# EAGLE design mymote-quake (EAGLE 8.0.1)
PROJECT_AUTHOR: TINKERMAN <xose.perez@gmail.com>; PROJECT_LICENSE: CC-SA-BY 3.0; PROJECT_NAME: MYMOTE QUAKE; PROJECT_VERSION: 0.1.20170508
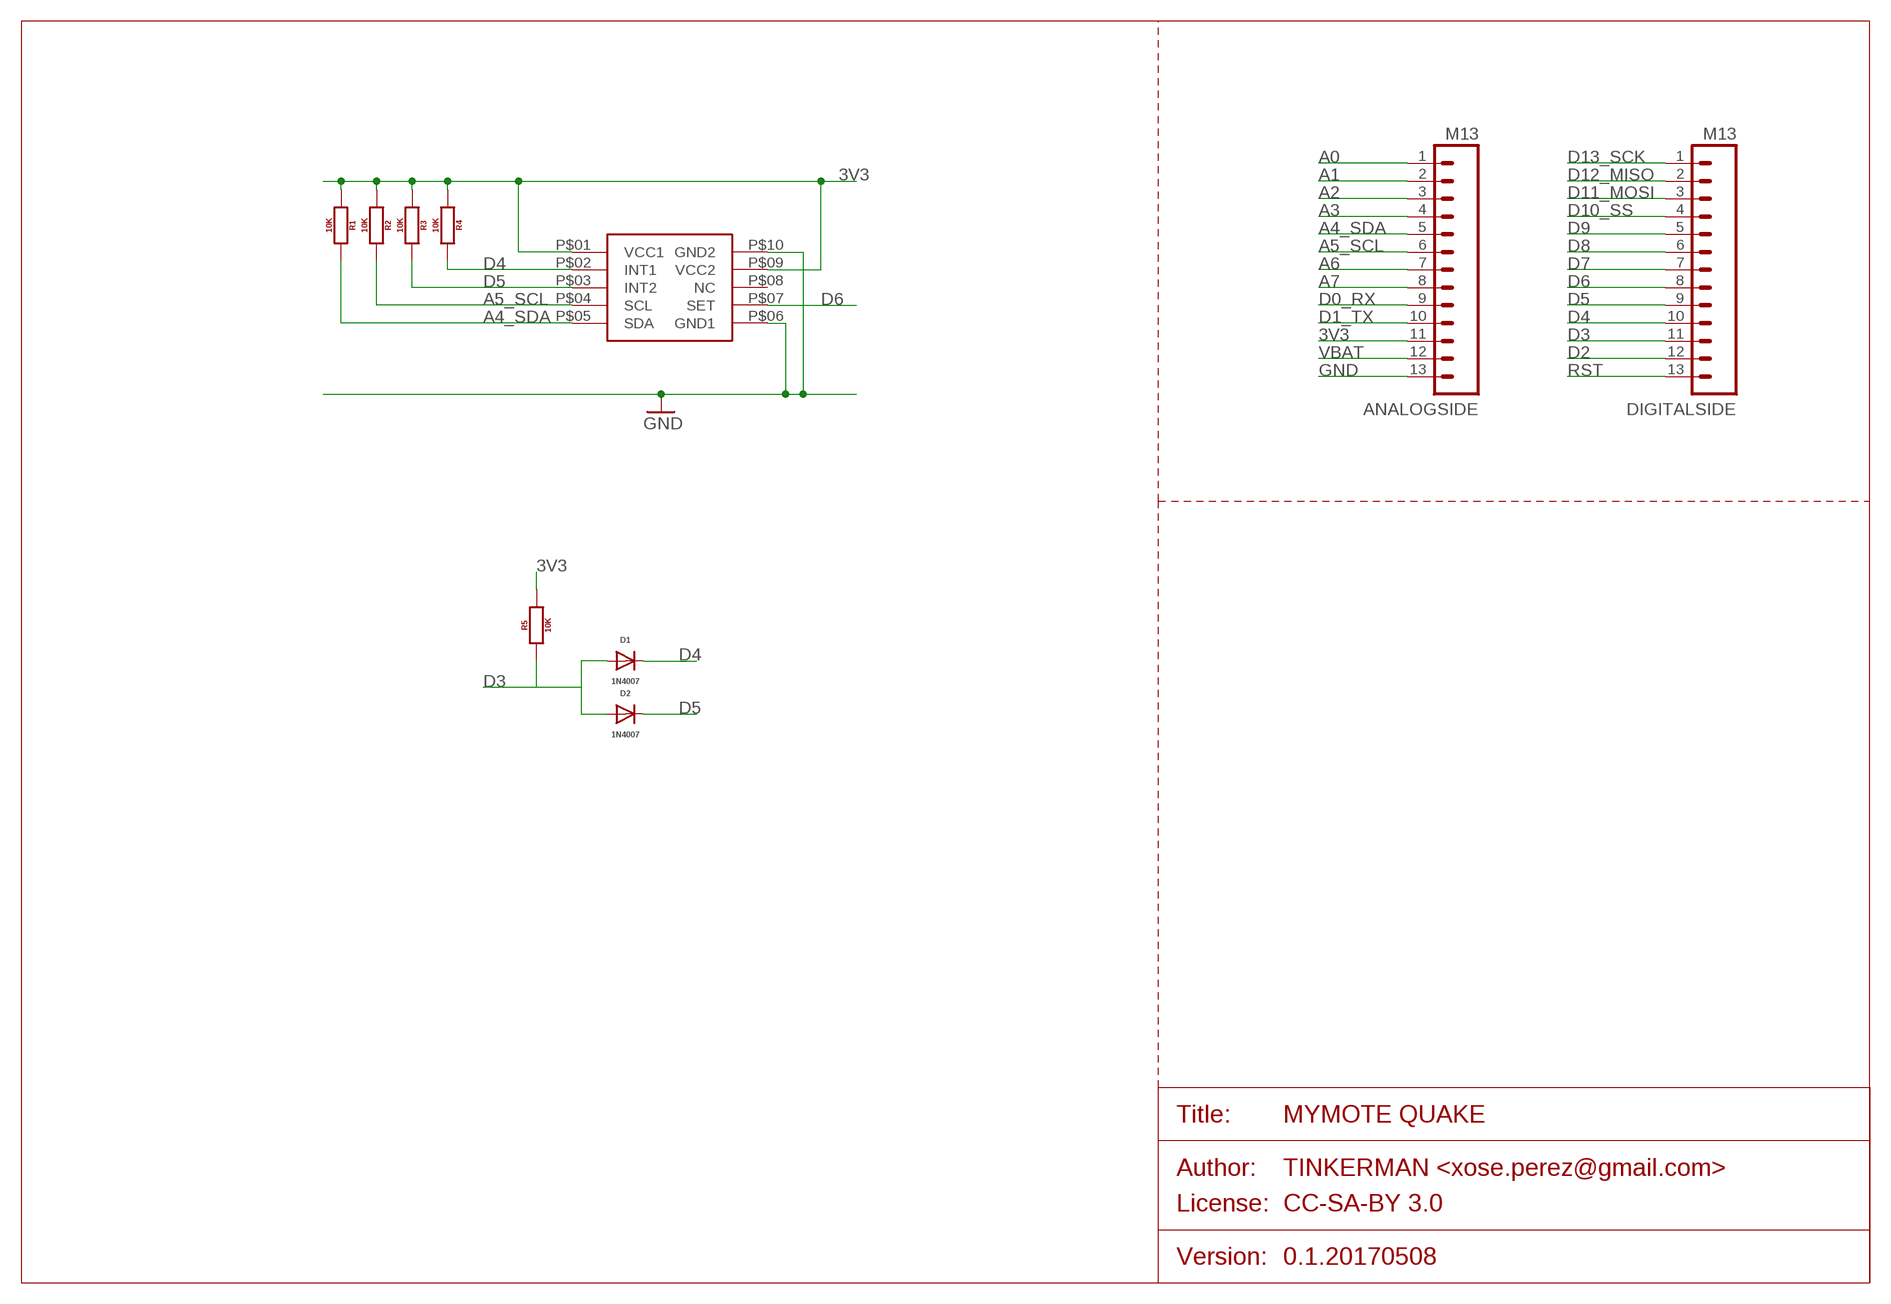
[diagram p0: schematic, sheet 1]

## Parts
ANALOGSIDE  M13  [1X13_NO_SILK]
D1  1N4007  DIODE-SMD  [0805_DIODE]
D2  1N4007  DIODE-SMD  [0805_DIODE]
DIGITALSIDE  M13  [1X13_NO_SILK]
R1  10K  RESISTOR0805  [0805]
R2  10K  RESISTOR0805  [0805]
R3  10K  RESISTOR0805  [0805]
R4  10K  RESISTOR0805  [0805]
R5  10K  RESISTOR0805  [0805]
U$1  D7S-A0001  [D7S-A0001]

## Nets
3V3: ANALOGSIDE.11 R1.1 R2.1 R3.1 R4.1 R5.2 U$1.P$01(VCC1) U$1.P$09(VCC2)
A0: ANALOGSIDE.1
A1: ANALOGSIDE.2
A2: ANALOGSIDE.3
A3: ANALOGSIDE.4
A4_SDA: ANALOGSIDE.5 R1.2 U$1.P$05(SDA)
A5_SCL: ANALOGSIDE.6 R2.2 U$1.P$04(SCL)
A6: ANALOGSIDE.7
A7: ANALOGSIDE.8
D0_RX: ANALOGSIDE.9
D1_TX: ANALOGSIDE.10
D2: DIGITALSIDE.12
D3: D1.A D2.A DIGITALSIDE.11 R5.1
D4: D1.C DIGITALSIDE.10 R4.2 U$1.P$02(INT1)
D5: D2.C DIGITALSIDE.9 R3.2 U$1.P$03(INT2)
D6: DIGITALSIDE.8 U$1.P$07(SET)
D7: DIGITALSIDE.7
D8: DIGITALSIDE.6
D9: DIGITALSIDE.5
D10_SS: DIGITALSIDE.4
D11_MOSI: DIGITALSIDE.3
D12_MISO: DIGITALSIDE.2
D13_SCK: DIGITALSIDE.1
GND [power]: ANALOGSIDE.13 U$1.P$06(GND1) U$1.P$10(GND2)
RST: DIGITALSIDE.13
VBAT: ANALOGSIDE.12
Unconnected: U$1.P$08(NC)

## Library data of the parts
ANALOGSIDE DIGITALSIDE = xose:M13
D1 D2 = xose:DIODE
R1-R5 = xose:RESISTOR: Generic EU resistor symbol
U$1 = xose:D7S-A0001

## Net classes
1 power: width 0.381 mm, clearance 0.254 mm

## Board
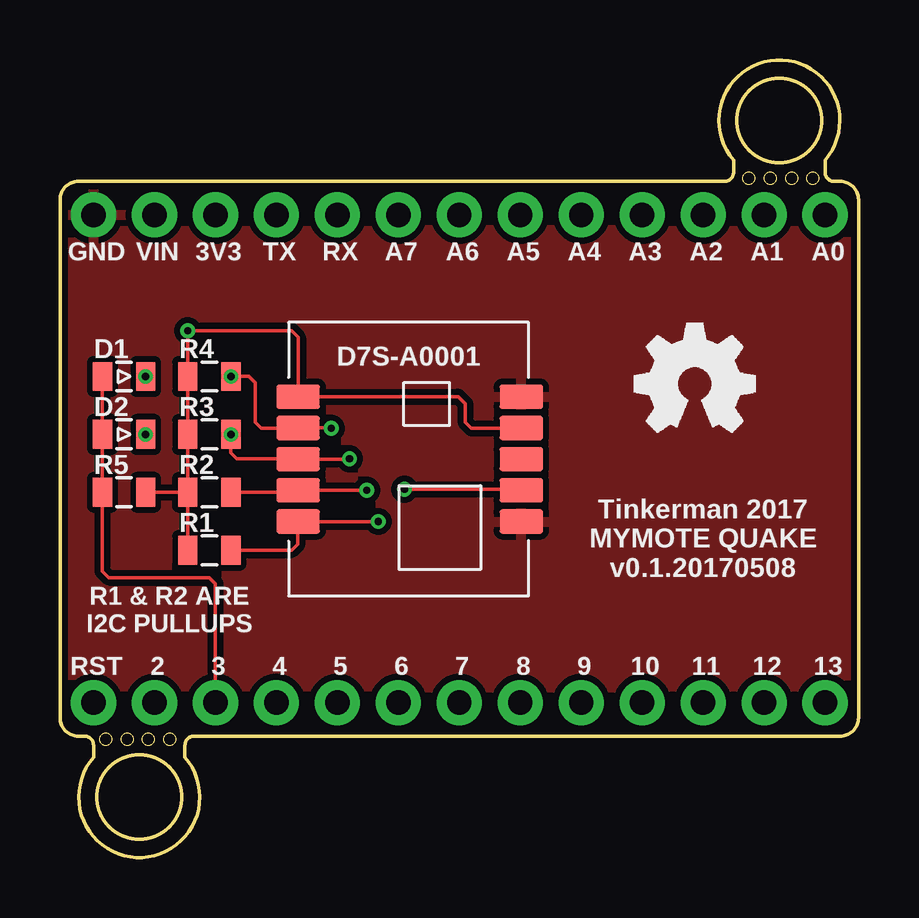
[diagram p1: board, top side]
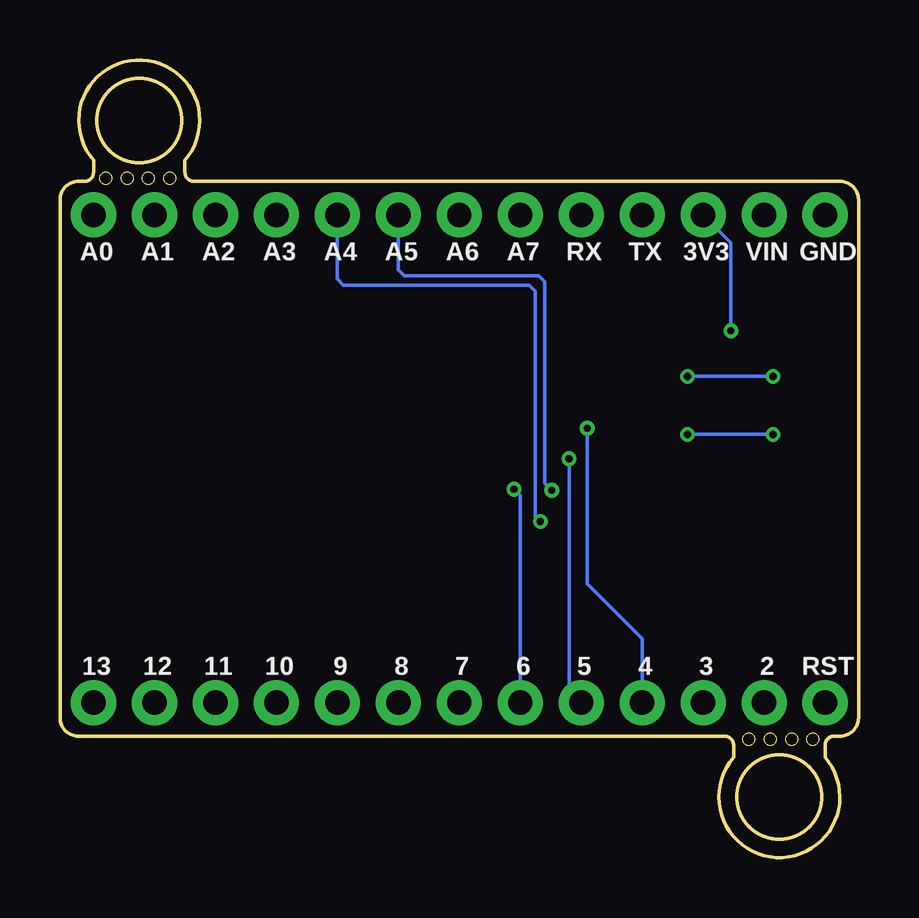
[diagram p2: board, bottom side, seen from below]

Size 33.27 x 33.23 mm. Coordinates in mm from the lower left corner, seen from the top.
Outline: 0.71,5.06 0.76,5.06
Outline: 0.76,28.17 0.71,28.17
Outline: 0,5.77 0,5.82
Outline: 0,27.41 0,27.46
Outline: 0,5.82 0,27.41
Outline: 0,27.41 arc-90 0.76,28.17
Outline: 0.76,5.06 1.02,5.06 arc-90 1.4,4.68 1.4,4.17 arc262 5.21,4.17 5.21,4.68 arc-90 5.59,5.06 32.51,5.06 arc90 33.27,5.82 33.27,27.41 arc90 32.51,28.17 32.26,28.17 arc-90 31.88,28.55 31.88,29.06 arc262 28.07,29.06 28.07,28.55 arc-90 27.69,28.17 0.76,28.17
Outline: 0.76,5.06 arc-90 0,5.82
Outline: circle at 3.3,2.52 radius 1.75
Outline: circle at 1.91,4.93 radius 0.25
Outline: circle at 2.79,4.93 radius 0.25
Outline: circle at 3.68,4.93 radius 0.25
Outline: circle at 29.97,30.71 radius 1.75
Outline: circle at 31.37,28.3 radius 0.25
Outline: circle at 30.48,28.3 radius 0.25
Outline: circle at 29.59,28.3 radius 0.25
Outline: circle at 4.57,4.93 radius 0.25
Outline: circle at 28.7,28.3 radius 0.25
Copper layers (1*16): Top 0.035mm / dielectric 1.5mm / Bottom 0.035mm
Design rules "seedstudio-2layer": minimum track width 6mil, minimum drill 12mil, track to track 6mil, track to pad 6mil, pad to pad 6mil, via to via 6mil, smd to smd 0mil, copper to edge 10mil, drill to drill 10mil, minimum pad ring 10mil, minimum via ring 6mil, stop-mask expansion 2mil, vias tented up to drill 100mil, thermal gap 10mil

### Footprints (pad centres in the part's own frame; a part is rotated, then mirrored left to right if it is on the bottom)
1X13_NO_SILK = drill 1.016 pad 1.88: 1 0,0; 2 2.54,0; 3 5.08,0; 4 7.62,0; 5 10.16,0; 6 12.7,0; 7 15.24,0; 8 17.78,0; 9 20.32,0; 10 22.86,0; 11 25.4,0; 12 27.94,0; 13 30.48,0
0805_DIODE = smd 0.8 x 1.2: A -0.9,0; C 0.9,0
0805 = smd 0.8 x 1.2: 1 -0.9,0; 2 0.9,0
D7S-A0001 = smd 1.8 x 1: P$01 0.4,8.3; P$02 0.4,7; P$03 0.4,5.7; P$04 0.4,4.4; P$05 0.4,3.1; P$06 9.7,3.1; P$07 9.7,4.4; P$08 9.7,5.7; P$09 9.7,7; P$10 9.7,8.3

### Placement (x,y rotation side)
ANALOGSIDE  31.88,26.77 180 top
D1  2.67,20.04 0 top
D2  2.67,17.63 0 top
DIGITALSIDE  31.88,6.45 180 top
R1  6.22,12.8 0 top
R2  6.22,15.22 0 top
R3  6.22,17.63 0 top
R4  6.22,20.04 0 top
R5  2.67,15.22 0 top
U$1  9.53,10.9 0 top

### Tracks (layer width: path | path; a pad name or v marks a point on that pad's centre or on a via)
3V3  (via drill 0.3)
  Top 0.152: R1.1 R2.1 | R5.2 R2.1 | R2.1 R3.1 R4.1 v5.32,21.95 9.65,21.95 9.93,21.68 U$1.P$01 16.59,19.2 16.89,18.9 16.89,18.14 17.14,17.88 19.21,17.88 U$1.P$09
  Bottom 0.152: v5.32,21.95 5.32,25.62 ANALOGSIDE.11
A4_SDA  (via drill 0.3)
  Top 0.152: R1.2 9.65,12.8 9.91,13.06 9.91,13.98 U$1.P$05 v13.26,14
  Bottom 0.152: v13.26,14 13.46,14.2 13.46,23.6 13.72,23.85 21.46,23.85 21.72,24.11 ANALOGSIDE.5
A5_SCL  (via drill 0.3)
  Top 0.152: R2.2 9.84,15.22 U$1.P$04 v12.78,15.3
  Bottom 0.152: v12.78,15.3 13.08,15.6 13.08,23.98 13.34,24.23 18.92,24.23 19.18,24.49 ANALOGSIDE.6
D3
  Top 0.152: D1.A D2.A R5.1 1.77,11.93 2.03,11.66 6.22,11.66 6.48,11.41 DIGITALSIDE.11
D4  (via drill 0.3)
  Top 0.152: R4.2 7.87,20.04 8.13,19.79 8.13,18.14 8.38,17.88 9.91,17.88 U$1.P$02 11.29,17.9 v11.3,17.88
  Bottom 0.152: v11.3,17.88 11.3,11.41 9.02,9.12 DIGITALSIDE.10 | D1.C R4.2 D1.C
  other vias: 3.57,20.04 7.12,20.04
D5  (via drill 0.3)
  Top 0.152: R3.2 7.12,16.86 7.37,16.61 9.91,16.61 U$1.P$03 12.05,16.6 v12.06,16.61
  Bottom 0.152: v12.06,16.61 12.06,6.96 DIGITALSIDE.9 | D2.C R3.2 D2.C
  other vias: 3.57,17.63 7.12,17.63
D6  (via drill 0.3)
  Top 0.152: v14.35,15.34 19.18,15.34 U$1.P$07
  Bottom 0.152: DIGITALSIDE.8 14.1,15.09 v14.35,15.34
GND
  pour Top: -0.76,29.7 33.66,29.7 33.78,4.55 -0.64,4.55

### Text on the board
tNames: GND | VIN | 3V3 | TX | RX | A7 | A6 | A5 | A4 | A3 | A2 | A1 | A0 | Tinkerman 2017 / MYMOTE QUAKE / v0.1.20170508 | R1 & R2 ARE / I2C PULLUPS | RST | 2 | 3 | 4 | 5 | 6 | 7 | 8 | 9 | 10 | 11 | 12 | 13
bNames: GND | VIN | 3V3 | TX | RX | A7 | A6 | A5 | A4 | A3 | A2 | A1 | A0 | RST | 2 | 3 | 4 | 5 | 6 | 7 | 8 | 9 | 10 | 11 | 12 | 13